# Altium schematic sheet AOP_Decoupling.SchDoc
size A; SheetNumber: 3; SheetTotal: 5
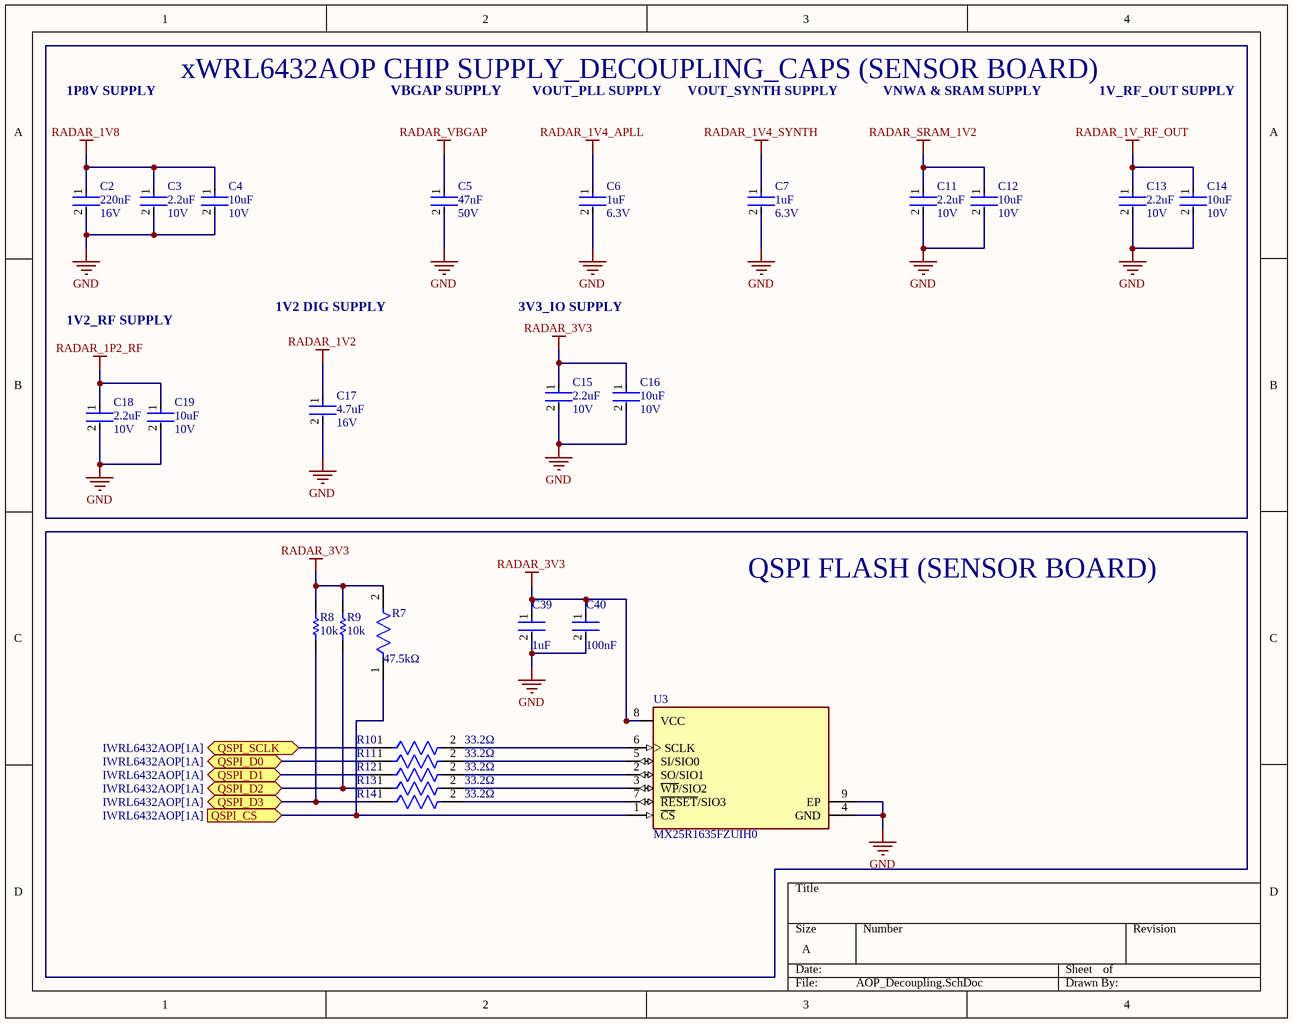
[diagram p0: AOP_Decoupling.SchDoc]

## Parts
C2  Capacitance: 220nF  Voltage: 16V  [FP-GRM155-0_05-IPC_C]  (hidden comment: GRM155R71C224KA12D)
C3  Capacitance: 2.2uF  Voltage: 10V  [FP-GRM155-0_05-IPC_A]  (hidden comment: GRM155R61A225ME01D)
C4  Voltage: 10V  Capacitance: 10uF  [FP-GRM188-0_2-IPC_B]  (hidden comment: GRM188Z71A106MA73D)
C5  Capacitance: 47nF  Voltage Rating (DC): 50V  [FP-C1005-050-0_05-IPC_C]  (hidden comment: C1005X7R1H473K050BB)
C6  Capacitance: 1uF  Voltage Rating: 6.3V  [FP-GRM155-0_05-MFG]  (hidden comment: GRM155R70J105KA12D)
C7  Capacitance: 1uF  Voltage Rating: 6.3V  [FP-GRM155-0_05-MFG]  (hidden comment: GRM155R70J105KA12D)
C11  Capacitance: 2.2uF  Voltage: 10V  [FP-GRM155-0_05-IPC_A]  (hidden comment: GRM155R61A225ME01D)
C12  Voltage: 10V  Capacitance: 10uF  [FP-GRM188-0_2-IPC_B]  (hidden comment: GRM188Z71A106MA73D)
C13  Capacitance: 2.2uF  Voltage: 10V  [FP-GRM155-0_05-IPC_A]  (hidden comment: GRM155R61A225ME01D)
C14  Voltage: 10V  Capacitance: 10uF  [FP-GRM188-0_2-IPC_B]  (hidden comment: GRM188Z71A106MA73D)
C15  Capacitance: 2.2uF  Voltage: 10V  [FP-GRM155-0_05-IPC_A]  (hidden comment: GRM155R61A225ME01D)
C16  Voltage: 10V  Capacitance: 10uF  [FP-GRM188-0_2-IPC_B]  (hidden comment: GRM188Z71A106MA73D)
C17  Voltage Rating (DC): 16V  Capacitance: 4.7uF  [FP-GCJ21B-0_3-IPC_C]  (hidden comment: GCJ21BR71C475KA01L)
C18  Capacitance: 2.2uF  Voltage: 10V  [FP-GRM155-0_05-IPC_A]  (hidden comment: GRM155R61A225ME01D)
C19  Voltage: 10V  Capacitance: 10uF  [FP-GRM188-0_2-IPC_B]  (hidden comment: GRM188Z71A106MA73D)
C39  Capacitance: 1uF  [FP-GRM155-0_05-IPC_C]  (hidden comment: GRM155C80J105KA12D)
C40  Capacitance: 100nF  [FP-C1005-050-IPC_C]  (hidden comment: C1005X7R1H104K050BE)
R7  Resistance: 47.5kΩ  [FP-RC0402-0_4-MFG]  (hidden comment: RC0402FR-1047K5L)
R8  10k  [RESC1005X40X25LL05T10]
R9  10k  [RESC1005X40X25LL05T10]
R10  Resistance: 33.2Ω  [FP-RT0402-0_35-MFG]  (hidden comment: RT0402FRE0733R2L)
R11  Resistance: 33.2Ω  [FP-RT0402-0_35-MFG]  (hidden comment: RT0402FRE0733R2L)
R12  Resistance: 33.2Ω  [FP-RT0402-0_35-MFG]  (hidden comment: RT0402FRE0733R2L)
R13  Resistance: 33.2Ω  [FP-RT0402-0_35-MFG]  (hidden comment: RT0402FRE0733R2L)
R14  Resistance: 33.2Ω  [FP-RT0402-0_35-MFG]  (hidden comment: RT0402FRE0733R2L)
U3  MX25R1635FZUIH0  [FP-USON-8-2x3mm-MFG]

## Ports
QSPI_CS (in, see IWRL6432AOP[1A]), QSPI_D0 (bidir, see IWRL6432AOP[1A]), QSPI_D1 (bidir, see IWRL6432AOP[1A]), QSPI_D2 (bidir, see IWRL6432AOP[1A]), QSPI_D3 (bidir, see IWRL6432AOP[1A]), QSPI_SCLK (bidir, see IWRL6432AOP[1A])

## Nets
GND: C2.2 C3.2 C4.2 C5.2 C6.2 C7.2 C11.2 C12.2 C13.2 C14.2 C15.2 C16.2 C17.2 C18.2 C19.2 C39.2 C40.2 U3.4(GND) U3.9(EP)
RADAR_1P2_RF: C18.1 C19.1
RADAR_1V2: C17.1
RADAR_1V4_APLL: C6.1
RADAR_1V4_SYNTH: C7.1
RADAR_1V8: C2.1 C3.1 C4.1
RADAR_1V_RF_OUT: C13.1 C14.1
RADAR_3V3: C15.1 C16.1 C39.1 C40.1 R7.2 R8.2 R9.2 U3.8(VCC)
RADAR_SRAM_1V2: C11.1 C12.1
RADAR_VBGAP: C5.1
QSPI_CS: R7.1 U3.1(~{CS}) ; port QSPI_CS
QSPI_D0: R11.1 ; port QSPI_D0
QSPI_D1: R12.1 ; port QSPI_D1
QSPI_D2: R9.1 R13.1 ; port QSPI_D2
QSPI_D3: R8.1 R14.1 ; port QSPI_D3
QSPI_SCLK: R10.1 ; port QSPI_SCLK
NetR10_2: R10.2 U3.6(SCLK)
NetR11_2: R11.2 U3.5(SI/SIO0)
NetR12_2: R12.2 U3.2(SO/SIO1)
NetR13_2: R13.2 U3.3(~{WP}/SIO2)
NetR14_2: R14.2 U3.7(~{RESET}/SIO3)

## Notes on the sheet
- 1P8V SUPPLY
- xWRL6432AOP CHIP SUPPLY_DECOUPLING_CAPS (SENSOR BOARD)
- VBGAP SUPPLY
- VOUT_PLL SUPPLY
- VOUT_SYNTH SUPPLY
- VNWA & SRAM SUPPLY
- 1V_RF_OUT SUPPLY
- 1V2_RF SUPPLY
- 1V2 DIG SUPPLY
- 3V3_IO SUPPLY
- QSPI FLASH (SENSOR BOARD)

## Library data of the parts
C2 = CMP-1034-02089-3: Chip Multilayer Ceramic Capacitors for General Purpose, 0402, 0.22uF, X7R, 15%, 10%, 16V; Depth: 0.5mm; Dielectric: X7R; Min Operating Temperature: -55°C; Package Quantity: 1; Termination: SMD/SMT; Mount: Surface Mount; Radiation Hardening: No; Height: 0.5mm; Case Code (Metric): 1005; Packaging: Tape and Reel; Material: Ceramic; Voltage Rating (DC): 16V; REACH SVHC: No SVHC; Voltage Rating: 16V; Length: 1mm; Tolerance: 10%; Thickness: 0.022inch; Case Code (Imperial): 0402; Max Operating Temperature: 125°C; Width: 0.02inch; Lead Free: Lead Free; Case/Package: 0402
C3 C11 C13 C15 C18 = CMP-06035-017182-1: Chip Multilayer Ceramic Capacitors for General Purpose, 0402, 2.2uF, X5R, 15%, 20%, 10V
C4 C12 C14 C16 C19 = CMP-06035-036920-1: Chip Multilayer Ceramic Capacitors for General Purpose, 0603, 10uF, X7R, 15%, 20%, 10V; Case/Package: 0603
C5 = CMP-2000-06006-2: Multilayer Ceramic Capacitors 47nF ±10% 50V X7R SMD 0402; Dissipation Factor: 5%; Weight: 2.3E-05oz; Max Operating Temperature: 125°C; Package Quantity: 1; Width: 0.02inch; Min Operating Temperature: -55°C; Length: 1mm; Dielectric: X7R; Voltage Rating: 50V; Number of Pins: 2; Lead Free: Lead Free; Voltage: 50V; Dielectric Material: Ceramic; Height: 0.5mm; Case Code (Metric): 1005; Construction: Flat; Termination: SMD/SMT; Case Code (Imperial): 0402; Depth: 0.5mm; Packaging: Tape and Reel; Mount: Surface Mount; Series: C; RoHS Compliant: Yes; Tolerance: 10%; Case/Package: 0402; Thickness: 0.022inch; Radiation Hardening: No; Resistor Type: Ceramic; REACH SVHC: No SVHC
C6 C7 = CMP-2008-04587-2: Chip Multilayer Ceramic Capacitors for General Purpose, 0402, 1.0uF, X7R, 15%, 10%, 6.3V; Case Code (Metric): 1005; Min Operating Temperature: -55°C; Tolerance: 10%; Depth: 0.5mm; Max Operating Temperature: 125°C; Width: 0.5mm; Case Code (Imperial): 0402; Termination: SMD/SMT; Weight: 0.000212oz; Thickness: 0.022inch; Package Quantity: 10000; Packaging: Tape and Reel; Lead Free: Lead Free; Height: 0.5mm; Length: 1mm; Dielectric: X7R; Case/Package: 0402; Voltage Rating (DC): 6.3V; Material: Ceramic; Mount: Surface Mount
C17 = CMP-06035-006740-1: Multilayer Ceramic Capacitors MLCC - SMD/SMT 0805 4.7uF 10%, 16VDC,  X7R 15%; Case Code (Imperial): 0805; Max Operating Temperature: 125°C; Package Quantity: 3000; Case/Package: 0805; Width: 1.25mm; Packaging: Tape and Reel; Length: 0.079inch; Dielectric: X7R; Ratings: AEC-Q200; Voltage Rating: 16V; Weight: 0.000335oz; Tolerance: 10%; Features: Soft Termination; Mount: Surface Mount; Termination: SMD/SMT; Thickness: 0.057inch; Height: 1.25mm; Case Code (Metric): 2012; Min Operating Temperature: -55°C; Lead Free: Lead Free
C39 = CMP-06035-011876-1: Chip Multilayer Ceramic Capacitors for General Purpose, 0402, 1.0uF, X6S, 22%, 10%, 6.3V; Dielectric: X6S; Width: 500um; Length: 1mm; Thickness: 500um; Tolerance: 10%; Voltage Rating (DC): 6.3V
C40 = CMP-08246-004330-1: CAP CER 0.1UF 50V X7R 0402; Tolerance: 10%; Max Operating Temperature: 125°C; Min Operating Temperature: -55°C; Width: 0.02inch; Case/Package: 0402; Case Code (Metric): 1005; Packaging: Tape and Reel; Length: 0.039inch; Features: Soft Termination; Thickness: 0.024inch; Voltage Rating: 50V; RoHS Compliant: Yes; Case Code (Imperial): 0402; Mount: Surface Mount
R7 = CMP-00621-30511908-1: RC0402FR-1047K5L General Purpose Chip Resistor Thick Film 0402 47.5kOhm 1% Paper T/R; RoHS: Non-Compliant; NexarPartId: 30511908; Packaging: Tape & Reel; Tolerance: 1%; Case/Package: 0402
R8 R9 = CMP-2002-07353-1: Part Number: RC0402FR-0710KL; Manufacturer: Yageo / Phycomp
R10-R14 = CMP-2002-03033-3: NexarPartId: 1272564; Max Power Dissipation: 63mW; Voltage Rating: 50V; Temperature Coefficient: 50ppm/°C; Tolerance: 1%; Packaging: Tape & Reel (TR); Radiation Hardening: No; Military Standard: Not; Contact Plating: Tin; Case Code (Metric): 0402; Max Operating Temperature: 125°C; Height: 350µm; Lead Free: Lead Free; Case/Package: 0402; Width: 508µm; Length: 990.6µm; RoHS: Compliant; Number of Terminations: 2; Voltage Rating (DC): 50V; Min Operating Temperature: -55°C; Power Rating: 63mW; Depth: 500µm; Composition: Thin Film
U3 = CMP-105207-000004-1: IC FLASH 16M SPI 80MHZ 8USON; Packaging: Tape and Reel; Max Operating Temperature: 85°C; Memory Type: FLASH; Lead Free: Lead Free; Interface: SPI; Min Operating Temperature: -40°C; Frequency: 80MHz